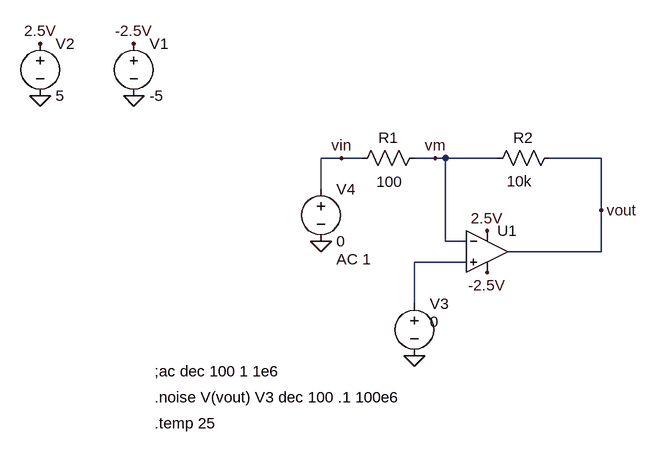
[diagram p0: schematic fb_amp_noise.asc]
fb_amp_noise.asc, the LTspice schematic file:
Version 4
SHEET 1 880 680
WIRE -32 48 -64 48
WIRE 0 48 -32 48
WIRE 112 48 80 48
WIRE 128 48 112 48
WIRE 208 48 128 48
WIRE 368 48 288 48
WIRE -64 96 -64 48
WIRE 368 128 368 48
WIRE 128 176 128 48
WIRE 160 176 128 176
WIRE 368 192 368 128
WIRE 368 192 224 192
WIRE 160 208 80 208
WIRE 80 272 80 208
FLAG -352 -48 0
FLAG -496 -48 0
FLAG -496 -128 2.5V
FLAG -352 -128 -2.5V
FLAG 192 160 2.5V
FLAG 192 224 -2.5V
FLAG 80 352 0
FLAG -64 176 0
FLAG 368 128 vout
FLAG -32 48 vin
FLAG 112 48 vm
SYMBOL Opamps\\UniversalOpamp2 192 192 R0
SYMATTR InstName U1
SYMATTR SpiceModel level.1
SYMATTR Value2 Avol=10Meg GBW=10Meg Slew=10Meg
SYMATTR SpiceLine2 en=10n enk=0 in=0 ink=0 Rin=500Meg
SYMBOL res 96 32 R90
WINDOW 0 0 56 VBottom 2
WINDOW 3 37 54 VTop 2
SYMATTR InstName R1
SYMATTR Value 100
SYMATTR SpiceLine tol=0.1
SYMBOL res 304 32 R90
WINDOW 0 0 56 VBottom 2
WINDOW 3 36 62 VTop 2
SYMATTR InstName R2
SYMATTR Value 10k
SYMBOL voltage -352 -144 R0
WINDOW 123 0 0 Left 0
WINDOW 39 0 0 Left 0
SYMATTR InstName V1
SYMATTR Value -5
SYMBOL voltage -496 -144 R0
WINDOW 123 0 0 Left 0
WINDOW 39 0 0 Left 0
SYMATTR InstName V2
SYMATTR Value 5
SYMBOL voltage 80 256 R0
WINDOW 3 24 44 Left 2
WINDOW 123 0 0 Left 0
WINDOW 39 0 0 Left 0
SYMATTR Value 0
SYMATTR InstName V3
SYMBOL voltage -64 80 R0
WINDOW 123 24 124 Left 2
WINDOW 39 0 0 Left 0
SYMATTR Value2 AC 1
SYMATTR InstName V4
SYMATTR Value 0
TEXT -320 416 Left 2 !.noise V(vout) V3 dec 100 .1 100e6
TEXT -320 456 Left 2 !.temp 25
TEXT -320 376 Left 2 !;ac dec 100 1 1e6

The netlist it stands for:
* fb_amp_noise.asc
XU1 N001 vm 2.5V -2.5V vout level.1 Avol=10Meg GBW=10Meg Slew=10Meg ilimit=25m rail=0 Vos=0 phimargin=45 en=10n enk=0 in=0 ink=0 Rin=500Meg  ; pins IN+ IN- V+ V- OUT
R1 vm vin 100 tol=0.1
R2 vout vm 10k
V1 -2.5V 0 -5
V2 2.5V 0 5
V3 N001 0 0
V4 vin 0 0 AC 1
.noise V(vout) V3 dec 100 .1 100e6
.temp 25
;ac dec 100 1 1e6
.lib UniversalOpamps2.sub
.backanno
.end